# EasyEDA schematic SCH_R2D2_2024-01-11.json
TITLE: R2D2 3-2-3 Mini; REV: 1.0; Date: 2023-10-12; Sheet: 1/1; Company: GJC
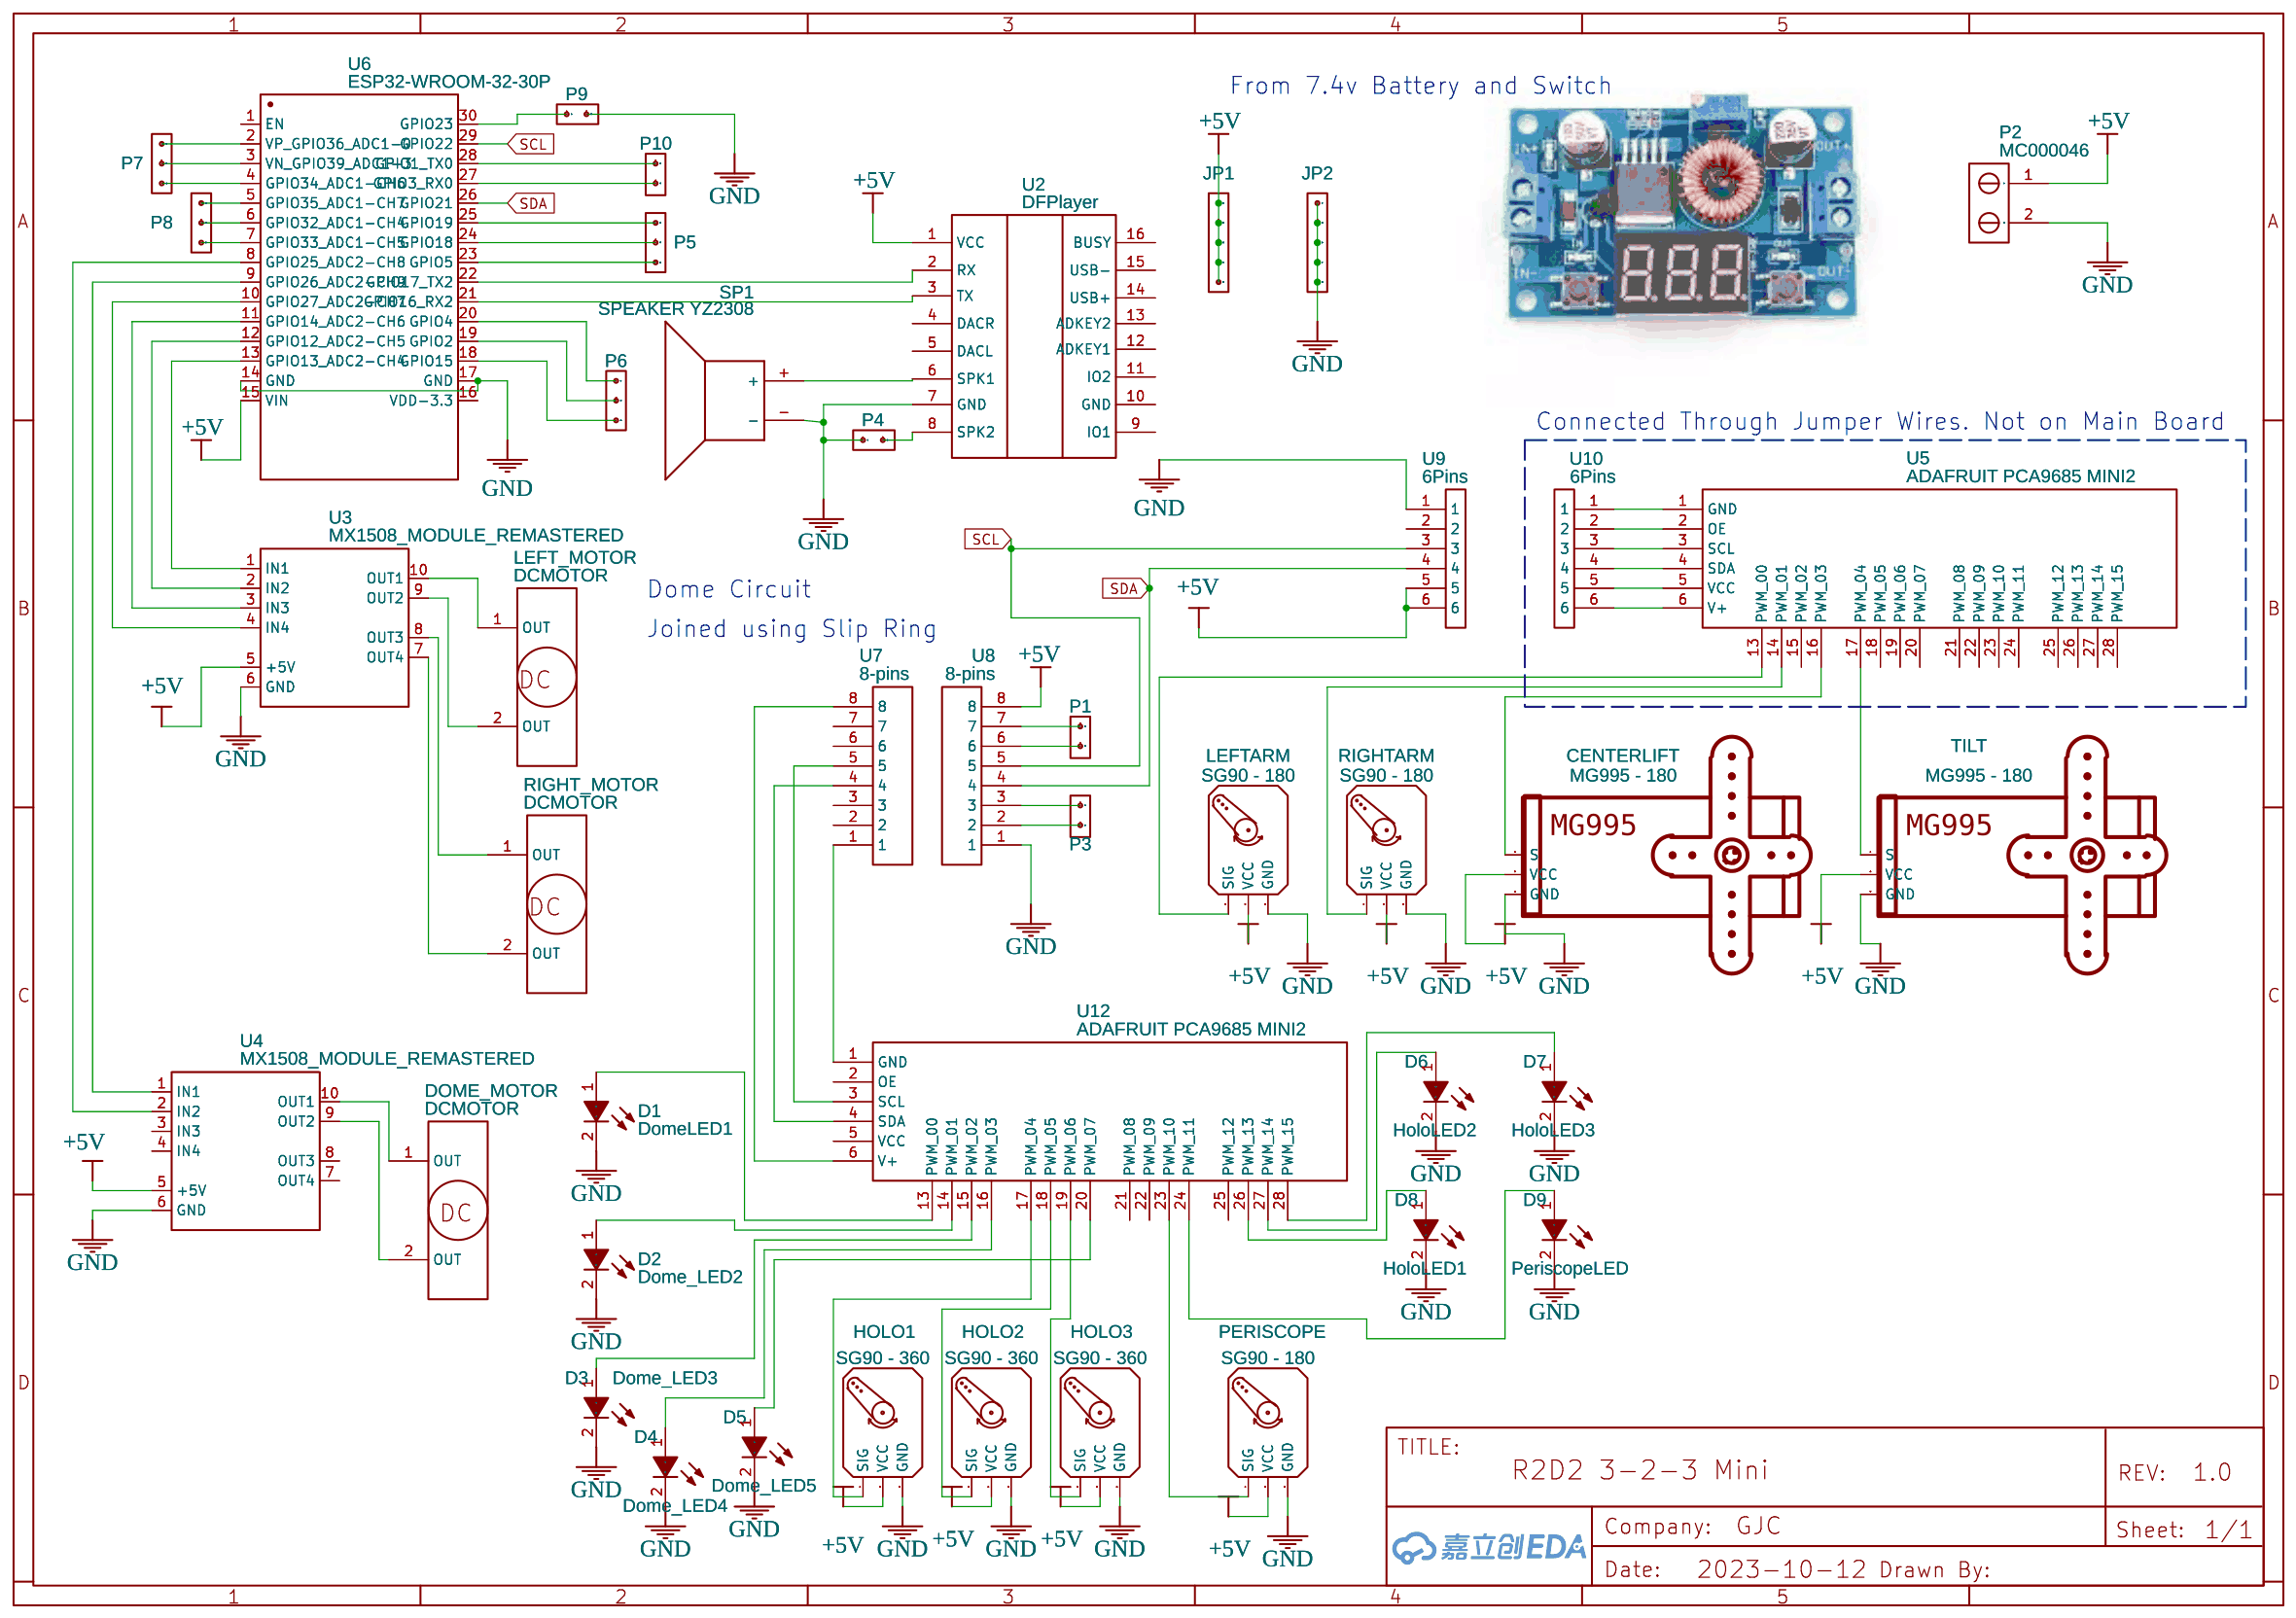
[diagram p0: schematic sheet]

## Parts
CENTERLIFT  MG995 - 180  [1X03]
D1  DomeLED1  [LED-TH_LED-DP2-2LED]
D2  Dome_LED2  [LED-TH_LED-DP2-2LED]
D3  Dome_LED3  [LED-TH_LED-DP2-2LED]
D4  Dome_LED4  [LED-TH_LED-DP2-2LED]
D5  Dome_LED5  [LED-TH_LED-DP2-2LED]
D6  HoloLED2  [LED-TH_LED-DP2-2LED]
D7  HoloLED3  [LED-TH_LED-DP2-2LED]
D8  HoloLED1  [LED-TH_LED-DP2-2LED]
D9  PeriscopeLED  [LED-TH_LED-DP2-2LED]
DOME_MOTOR  DCMOTOR  [TERMINALPINS]
HOLO1  SG90 - 360  [SG90]
HOLO2  SG90 - 360  [SG90]
HOLO3  SG90 - 360  [SG90]
JP1  1X5PIN  [1X5PIN]
JP2  1X5PIN  [1X5PIN]
LEFT_MOTOR  DCMOTOR  [TERMINALPINS]
LEFTARM  SG90 - 180  [SG90]
P1  1X2PIN  [1X2PIN]
P2  MC000046  [PKG-MC000046]
P3  1X2PIN  [1X2PIN]
P4  1X2PIN  [1X2PIN]
P5  1X3PIN  [1X3PIN]
P6  1X3PIN  [1X3PIN]
P7  1X3PIN  [1X3PIN]
P8  1X3PIN  [1X3PIN]
P9  1X2PIN  [1X2PIN]
P10  1X2PIN  [1X2PIN]
PERISCOPE  SG90 - 180  [SG90]
RIGHT_MOTOR  DCMOTOR  [TERMINALPINS]
RIGHTARM  SG90 - 180  [SG90]
SP1  SPEAKER YZ2308  [YZ2308 SPEAKER]
TILT  MG995 - 180  [1X03]
U2  DFPlayer  [DFPLAYER]
U3  MX1508_MODULE_REMASTERED  [MX1508]
U4  MX1508_MODULE_REMASTERED  [MX1508]
U5  ADAFRUIT PCA9685 MINI2  [ADAFRUIT PCA9685 MINI2]
U6  ESP32-WROOM-32-30P  [ESP32-WROOM-30P-FP]
U7  8-pins  [8PINS]
U8  8-pins  [8PINS]
U9  6Pins  [6PINS]
U10  6Pins  [6PINS]
U12  ADAFRUIT PCA9685 MINI2  [ADAFRUIT PCA9685 MINI2]

## Library data of the parts
CENTERLIFT TILT = Servomotor_MG995: Small servo motor; Contributor: RickSunCheeseBurger
D1-D9 = 3mm Green TH LED 5600: Supplier: Digi-Key; Manufacturer: VccLite; Supplier Part: L20325-ND; link: https://vcclite.com/product/5602f5-5v/; Contributor: dhiyaikmal
DOME_MOTOR LEFT_MOTOR RIGHT_MOTOR = DCMOTOR: Contributor: nabizadehm68
HOLO1-HOLO3 LEFTARM PERISCOPE = SG90_Servo: Contributor: arkanoor09; Package Display: No
JP1 JP2 = 1X5PIN: Contributor: karlab
P1 P3 P4 P9 P10 = 1X2PIN: Contributor: jefffknopp
P2 = MC000046: Supplier Part: 2008017; Supplier: Element14; Manufacturer: MULTICOMP; link: http://www.farnell.com/datasheets/2151599.pdf?_ga=2.250820485.2075366404.1513863926-238689616.1505921947&_gac=1.237760052.1513863926.EAIaIQobChMIl7zkxp6b2AIVHvEbCh1OkwhGEAAYASAAEgKMFvD_BwE; Contributor: Prof. Ing. F. Scordino
P5-P8 = 1X3PIN: Contributor: karlab
RIGHTARM = SG90_Servo: Contributor: arkanoor09
SP1 = SPEAKER YZ2308: Contributor: migumaus; sourceId: zB1YWUus2; Manufacturer Part: YZ2308
U2 = DFPlayer: Supplier: LCSC; Contributor: Vot Eto Tema
U3 U4 = MX1508_MODULE_REMASTERED: Contributor: ivan0kurnia
U5 = ADAFRUIT PCA9685 MINI2: Contributor: theresq
U6 = ESP32-WROOM-32-30P: Supplier: LCSC; Supplier Part: C82899; Manufacturer: Espressif Systems; Contributor: yeakharr; JLCPCB Part Class: Extended Part
U7 = 8-pins: Contributor: mchami; Package Display: No
U8 = 8-pins: Contributor: mchami
U9 U10 = 6Pins: Contributor: mchami
U12 = ADAFRUIT PCA9685 MINI2: Contributor: theresq; Package Display: No

## Nets
+5V: CENTERLIFT.2(VCC) HOLO1.2(VCC) HOLO2.2(VCC) HOLO3.2(VCC) JP1.1 JP1.2 JP1.3 JP1.4 JP1.5 LEFTARM.2(VCC) P2.1 PERISCOPE.2(VCC) RIGHTARM.2(VCC) TILT.2(VCC) U2.1(VCC) U3.5(+5V) U4.5(+5V) U6.15(VIN) U8.8 U9.5 U9.6
GND: CENTERLIFT.3(GND) D1.2(K) D2.2(K) D3.2(K) D4.2(K) D5.2(K) D6.2(K) D7.2(K) D8.2(K) D9.2(K) HOLO1.3(GND) HOLO2.3(GND) HOLO3.3(GND) JP2.1 JP2.2 JP2.3 JP2.4 JP2.5 LEFTARM.3(GND) P2.2 P4.1 P9.2 PERISCOPE.3(GND) RIGHTARM.3(GND) SP1.- TILT.3(GND) U2.7(GND) U3.6(GND) U4.6(GND) U6.14(GND) U6.17(GND) U8.1 U9.1
SCL: U6.29(GPIO22) U8.5 U9.3
SDA: U6.26(GPIO21) U8.4 U9.4
Net-(CENTERLIFT-1): CENTERLIFT.1(S) U5.16(PWM_03)
Net-(D1-1): D1.1(A) U12.13(PWM_00)
Net-(D2-1): D2.1(A) U12.14(PWM_01)
Net-(D3-1): D3.1(A) U12.15(PWM_02)
Net-(D4-1): D4.1(A) U12.16(PWM_03)
Net-(D5-1): D5.1(A) U12.20(PWM_07)
Net-(D6-1): D6.1(A) U12.27(PWM_14)
Net-(D7-1): D7.1(A) U12.28(PWM_15)
Net-(D8-1): D8.1(A) U12.26(PWM_13)
Net-(D9-1): D9.1(A) U12.24(PWM_11)
Net-(DOME_MOTOR-1): DOME_MOTOR.1(OUT) U4.10(OUT1)
Net-(DOME_MOTOR-2): DOME_MOTOR.2(OUT) U4.9(OUT2)
Net-(HOLO1-1): HOLO1.1(SIG) U12.17(PWM_04)
Net-(HOLO2-1): HOLO2.1(SIG) U12.18(PWM_05)
Net-(HOLO3-1): HOLO3.1(SIG) U12.19(PWM_06)
Net-(LEFT_MOTOR-1): LEFT_MOTOR.1(OUT) U3.10(OUT1)
Net-(LEFT_MOTOR-2): LEFT_MOTOR.2(OUT) U3.9(OUT2)
Net-(LEFTARM-1): LEFTARM.1(SIG) U5.13(PWM_00)
Net-(P1-1): P1.1 U8.7
Net-(P1-2): P1.2 U8.6
Net-(P3-1): P3.1 U8.3
Net-(P3-2): P3.2 U8.2
Net-(P4-2): P4.2 U2.8(SPK2)
Net-(P5-1): P5.1 U6.25(GPIO19)
Net-(P5-2): P5.2 U6.24(GPIO18)
Net-(P5-3): P5.3 U6.23(GPIO5)
Net-(P6-1): P6.1 U6.20(GPIO4)
Net-(P6-2): P6.2 U6.19(GPIO2)
Net-(P6-3): P6.3 U6.18(GPIO15)
Net-(P7-1): P7.1 U6.2(VP_GPIO36_ADC1-0)
Net-(P7-2): P7.2 U6.3(VN_GPIO39_ADC1-3)
Net-(P7-3): P7.3 U6.4(GPIO34_ADC1-CH6)
Net-(P8-1): P8.1 U6.5(GPIO35_ADC1-CH7)
Net-(P8-2): P8.2 U6.6(GPIO32_ADC1-CH4)
Net-(P8-3): P8.3 U6.7(GPIO33_ADC1-CH5)
Net-(P9-1): P9.1 U6.30(GPIO23)
Net-(P10-1): P10.1 U6.28(GPIO1_TX0)
Net-(P10-2): P10.2 U6.27(GPIO3_RX0)
Net-(PERISCOPE-1): PERISCOPE.1(SIG) U12.23(PWM_10)
Net-(RIGHT_MOTOR-1): RIGHT_MOTOR.1(OUT) U3.8(OUT3)
Net-(RIGHT_MOTOR-2): RIGHT_MOTOR.2(OUT) U3.7(OUT4)
Net-(RIGHTARM-1): RIGHTARM.1(SIG) U5.14(PWM_01)
Net-(SP1-+): SP1.+ U2.6(SPK1)
Net-(TILT-1): TILT.1(S) U5.17(PWM_04)
Net-(U2-2): U2.2(RX) U6.22(GPIO17_TX2)
Net-(U2-3): U2.3(TX) U6.21(GPIO16_RX2)
Net-(U3-1): U3.1(IN1) U6.13(GPIO13_ADC2-CH4)
Net-(U3-2): U3.2(IN2) U6.12(GPIO12_ADC2-CH5)
Net-(U3-3): U3.3(IN3) U6.11(GPIO14_ADC2-CH6)
Net-(U3-4): U3.4(IN4) U6.10(GPIO27_ADC2-CH7)
Net-(U4-1): U4.1(IN1) U6.9(GPIO26_ADC2-CH9)
Net-(U4-2): U4.2(IN2) U6.8(GPIO25_ADC2-CH8)
Net-(U5-1): U5.1(GND) U10.1
Net-(U5-2): U5.2(OE) U10.2
Net-(U5-3): U5.3(SCL) U10.3
Net-(U5-4): U5.4(SDA) U10.4
Net-(U5-5): U5.5(VCC) U10.5
Net-(U5-6): U5.6(V+) U10.6
Net-(U7-1): U7.1 U12.1(GND)
Net-(U7-4): U7.4 U12.4(SDA)
Net-(U7-5): U7.5 U12.3(SCL)
Net-(U7-8): U7.8 U12.6(V+)

Not connected (* = marked no-connect by the designer): U2 4(DACR) 5(DACL) 9(IO1) 10(GND) 11(IO2) 12(ADKEY1) 13(ADKEY2) 14(USB+) 15(USB-) 16(BUSY); U4 3(IN3) 4(IN4) 7(OUT4) 8(OUT3); U5 15(PWM_02) 18(PWM_05) 19(PWM_06) 20(PWM_07) 21(PWM_08) 22(PWM_09) 23(PWM_10) 24(PWM_11) 25(PWM_12) 26(PWM_13) 27(PWM_14) 28(PWM_15); U6 1(EN) 16(VDD-3.3); U7 2 3 6 7; U9 2; U12 2(OE) 5(VCC) 21(PWM_08) 22(PWM_09) 25(PWM_12)

## Notes on the sheet
- From 7.4v Battery and Switch
- Connected Through Jumper Wires. Not on Main Board
- Dome Circuit
- Joined using Slip Ring
